# EAGLE design PetitCool_MainShield (EAGLE 7.3.0)
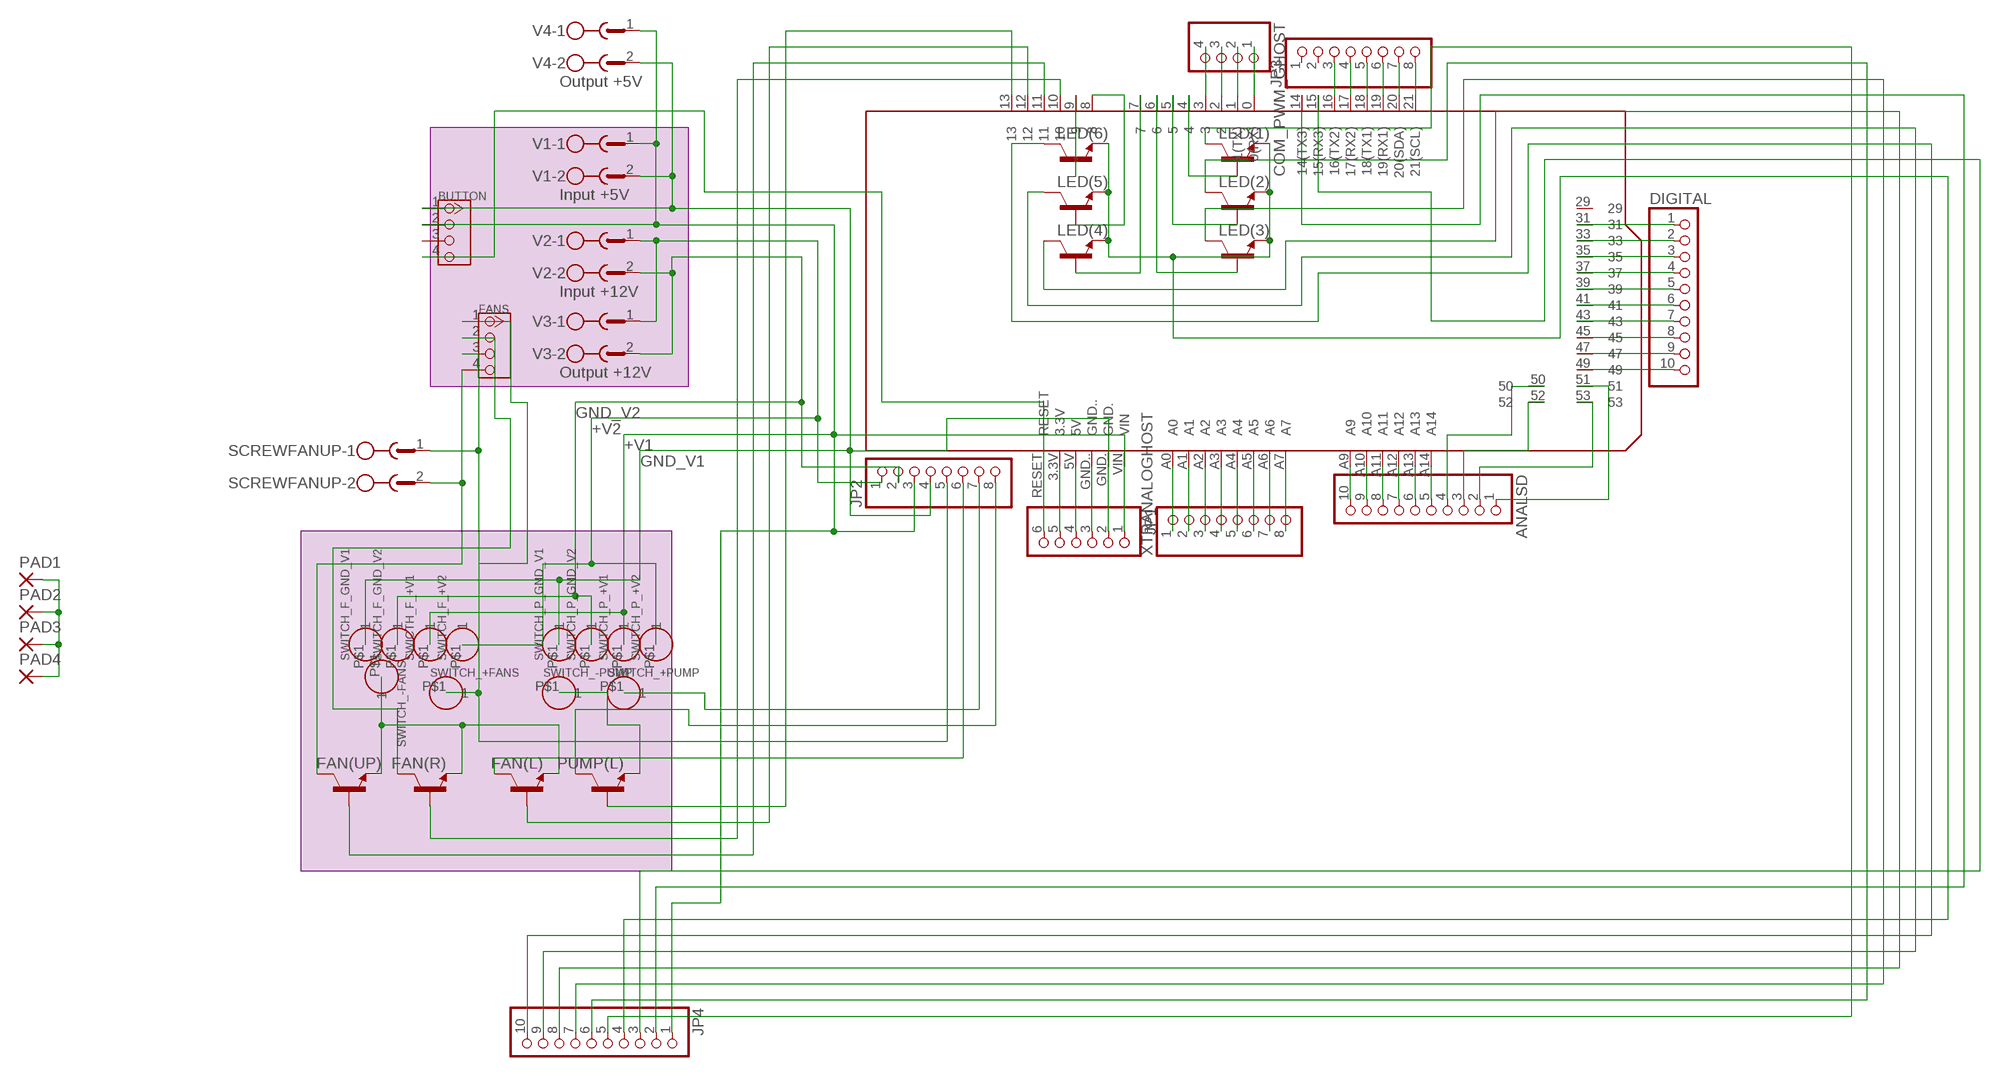
[diagram p0: schematic, sheet 1]

## Parts
ANALSD  PINHD-1X10  [1X10]
BUTTON  TWIG-4P-2.0-2.0  [4P-2.0]
COM_PWM_GHOST  PINHD-1X4  [1X04]
DIGITAL  PINHD-1X10  [1X10]
FAN(L)  DAR500  [DAR500]
FAN(R)  DAR500  [DAR500]
FAN(UP)  DAR500  [DAR500]
FANS  TWIG-4P-2.0-2.0  [4P-2.0]
JP1  PINHD-1X6  [1X06]
JP2  PINHD-1X8  [1X08]
JP3  PINHD-1X8  [1X08]
JP4  PINHD-1X10  [1X10]
LED(1)  DAR500  [DAR500]
LED(2)  DAR500  [DAR500]
LED(3)  DAR500  [DAR500]
LED(4)  DAR500  [DAR500]
LED(5)  DAR500  [DAR500]
LED(6)  DAR500  [DAR500]
PAD1  2,15/1,0  [2,15/1,0]
PAD2  2,15/1,0  [2,15/1,0]
PAD3  2,15/1,0  [2,15/1,0]
PAD4  2,15/1,0  [2,15/1,0]
PCB1  SHIELD_MEGA  [SHIELD_MEGA]
PUMP(L)  DAR500  [DAR500]
SCREWFANUP  MSTBV2  [MSTBV2]
SWICTH_F_+V1  HEADER-1P-70  [1P-100/70MIL]
SWITCH_+FANS  HEADER-1P-70  [1P-100/70MIL]
SWITCH_+PUMP  HEADER-1P-70  [1P-100/70MIL]
SWITCH_-FANS  HEADER-1P-70  [1P-100/70MIL]
SWITCH_-PUMP  HEADER-1P-70  [1P-100/70MIL]
SWITCH_F_+V2  HEADER-1P-70  [1P-100/70MIL]
SWITCH_F_GND_V1  HEADER-1P-70  [1P-100/70MIL]
SWITCH_F_GND_V2  HEADER-1P-70  [1P-100/70MIL]
SWITCH_P_+V1  HEADER-1P-70  [1P-100/70MIL]
SWITCH_P_+V2  HEADER-1P-70  [1P-100/70MIL]
SWITCH_P_GND_V1  HEADER-1P-70  [1P-100/70MIL]
SWITCH_P_GND_V2  HEADER-1P-70  [1P-100/70MIL]
V1  Input +5V  MSTBV2  [MSTBV2]
V2  Input +12V  MSTBV2  [MSTBV2]
V3  Output +12V  MSTBV2  [MSTBV2]
V4  Output +5V  MSTBV2  [MSTBV2]
XTRANALOGHOST  PINHD-1X8  [1X08]

## Nets
+FAN(UP/R/L): FANS.1 FANS.3 JP2.5 SCREWFANUP.1 SWITCH_+FANS.P$1
+PUMP: JP2.7 SWITCH_+PUMP.P$1
+V1: BUTTON.2 JP1.1 JP2.3 JP4.1 PCB1.VIN SWICTH_F_+V1.P$1 SWITCH_P_+V1.P$1 V1.1 V4.1
+V2: JP2.1 SWITCH_F_+V2.P$1 SWITCH_P_+V2.P$1 V2.1 V3.1
-FAN(L): FAN(L).1(C) JP2.6
-FAN(R): FAN(R).1(C) FANS.2
-FAN(UP): FAN(UP).1(C) FANS.4 SCREWFANUP.2
-FANS: FAN(L).3(E) FAN(R).3(E) FAN(UP).3(E) SWITCH_-FANS.P$1
-LED(1): JP4.5 LED(1).1(C)
-LED(2): JP4.6 LED(2).1(C)
-LED(3): JP4.7 LED(3).1(C)
-LED(4): JP4.8 LED(4).1(C)
-LED(5): JP4.9 LED(5).1(C)
-LED(6): JP4.10 LED(6).1(C)
-LEDS: JP4.4 LED(1).3(E) LED(2).3(E) LED(3).3(E) LED(4).3(E) LED(5).3(E) LED(6).3(E)
-PUMP: PUMP(L).3(E) SWITCH_-PUMP.P$1
-PUMP(L): JP2.8 PUMP(L).1(C)
CAM(RX): JP4.3 PCB1.15(15(RX3))
CAM(TX): JP4.2 PCB1.14(14(TX3))
CTRL_FAN(L): FAN(L).2(B) PCB1.12
CTRL_FAN(R): FAN(R).2(B) PCB1.10
CTRL_FAN(UP): FAN(UP).2(B) PCB1.11
CTRL_PUMP: PCB1.13 PUMP(L).2(B)
GND_V1: BUTTON.1 JP1.2 JP2.4 PAD1.1(P) PAD2.1(P) PAD3.1(P) PAD4.1(P) PCB1.GND. SWITCH_F_GND_V1.P$1 SWITCH_P_GND_V1.P$1 V1.2 V4.2
GND_V2: JP2.2 SWITCH_F_GND_V2.P$1 SWITCH_P_GND_V2.P$1 V2.2 V3.2
N$1: ANALSD.3 PCB1.52
N$2: ANALSD.2 PCB1.53
N$3: ANALSD.1 PCB1.51
N$5: JP1.5 PCB1.3.3V
N$6: JP1.4 PCB1.5V
N$7: JP1.3 PCB1.GND..
N$8: COM_PWM_GHOST.1 PCB1.0(0(RX))
N$9: COM_PWM_GHOST.2 PCB1.1(1(TX))
N$10: COM_PWM_GHOST.3 PCB1.2
N$11: COM_PWM_GHOST.4 PCB1.3
N$12: ANALSD.10 PCB1.A9
N$13: ANALSD.9 PCB1.A10
N$14: ANALSD.8 PCB1.A11
N$15: ANALSD.7 PCB1.A12
N$16: ANALSD.6 PCB1.A13
N$17: ANALSD.5 PCB1.A14
N$19: LED(1).2(B) PCB1.4
N$20: DIGITAL.1 PCB1.31
N$21: DIGITAL.2 PCB1.33
N$22: DIGITAL.3 PCB1.35
N$23: DIGITAL.4 PCB1.37
N$24: DIGITAL.5 PCB1.39
N$25: DIGITAL.6 PCB1.41
N$26: DIGITAL.7 PCB1.43
N$27: DIGITAL.8 PCB1.45
N$28: DIGITAL.9 PCB1.47
N$29: DIGITAL.10 PCB1.49
N$30: PCB1.A0 XTRANALOGHOST.1
N$31: PCB1.A1 XTRANALOGHOST.2
N$32: PCB1.A2 XTRANALOGHOST.3
N$33: ANALSD.4 PCB1.50
N$34: PCB1.A3 XTRANALOGHOST.4
N$35: PCB1.A4 XTRANALOGHOST.5
N$36: PCB1.A5 XTRANALOGHOST.6
N$37: LED(2).2(B) PCB1.5
N$38: LED(3).2(B) PCB1.6
N$39: LED(4).2(B) PCB1.7
N$40: LED(5).2(B) PCB1.8
N$41: LED(6).2(B) PCB1.9
N$42: PCB1.A6 XTRANALOGHOST.7
N$43: PCB1.A7 XTRANALOGHOST.8
RESET: BUTTON.4 JP1.6 PCB1.RESET
RX_BT: JP3.4 PCB1.17(17(RX2))
RX_LEDBAR: JP3.6 PCB1.19(19(RX1))
SCL_(RTC+4D): JP3.8 PCB1.21(21(SCL))
SDA_(RTC+4D): JP3.7 PCB1.20(20(SDA))
TX_BT: JP3.3 PCB1.16(16(TX2))
TX_LEDBAR: JP3.5 PCB1.18(18(TX1))
Unconnected: BUTTON.3 JP3.1 JP3.2 PCB1.29

## Library data of the parts
ANALSD DIGITAL JP4 = pinhead:PINHD-1X10: PIN HEADER
BUTTON FANS = Connector:TWIG-4P-2.0
COM_PWM_GHOST = pinhead:PINHD-1X4: PIN HEADER
FAN(L) FAN(R) FAN(UP) LED(1) LED(2) LED(3) LED(4) LED(5) LED(6) PUMP(L) = Biobot_1105:DAR500: NPN Transistor : DARLINGTON 500 mA
JP1 = pinhead:PINHD-1X6: PIN HEADER
JP2 JP3 XTRANALOGHOST = pinhead:PINHD-1X8: PIN HEADER
PAD1-PAD4 = wirepad:2,15/1,0: THROUGH-HOLE PAD
PCB1 = PetitCool_Arduino:SHIELD_MEGA: Device for representing
SCREWFANUP V1-V4 = con-phoenix-508:MSTBV2: PHOENIX; MPN: MSTBV 2,5/2-GF-5.08; OC_FARNELL: 1792792; OC_NEWARK: 69R9845
SWICTH_F_+V1 SWITCH_+FANS SWITCH_+PUMP SWITCH_-FANS SWITCH_-PUMP SWITCH_F_+V2 SWITCH_F_GND_V1 SWITCH_F_GND_V2 SWITCH_P_+V1 SWITCH_P_+V2 SWITCH_P_GND_V1 SWITCH_P_GND_V2 = Connector:HEADER-1P

## Board
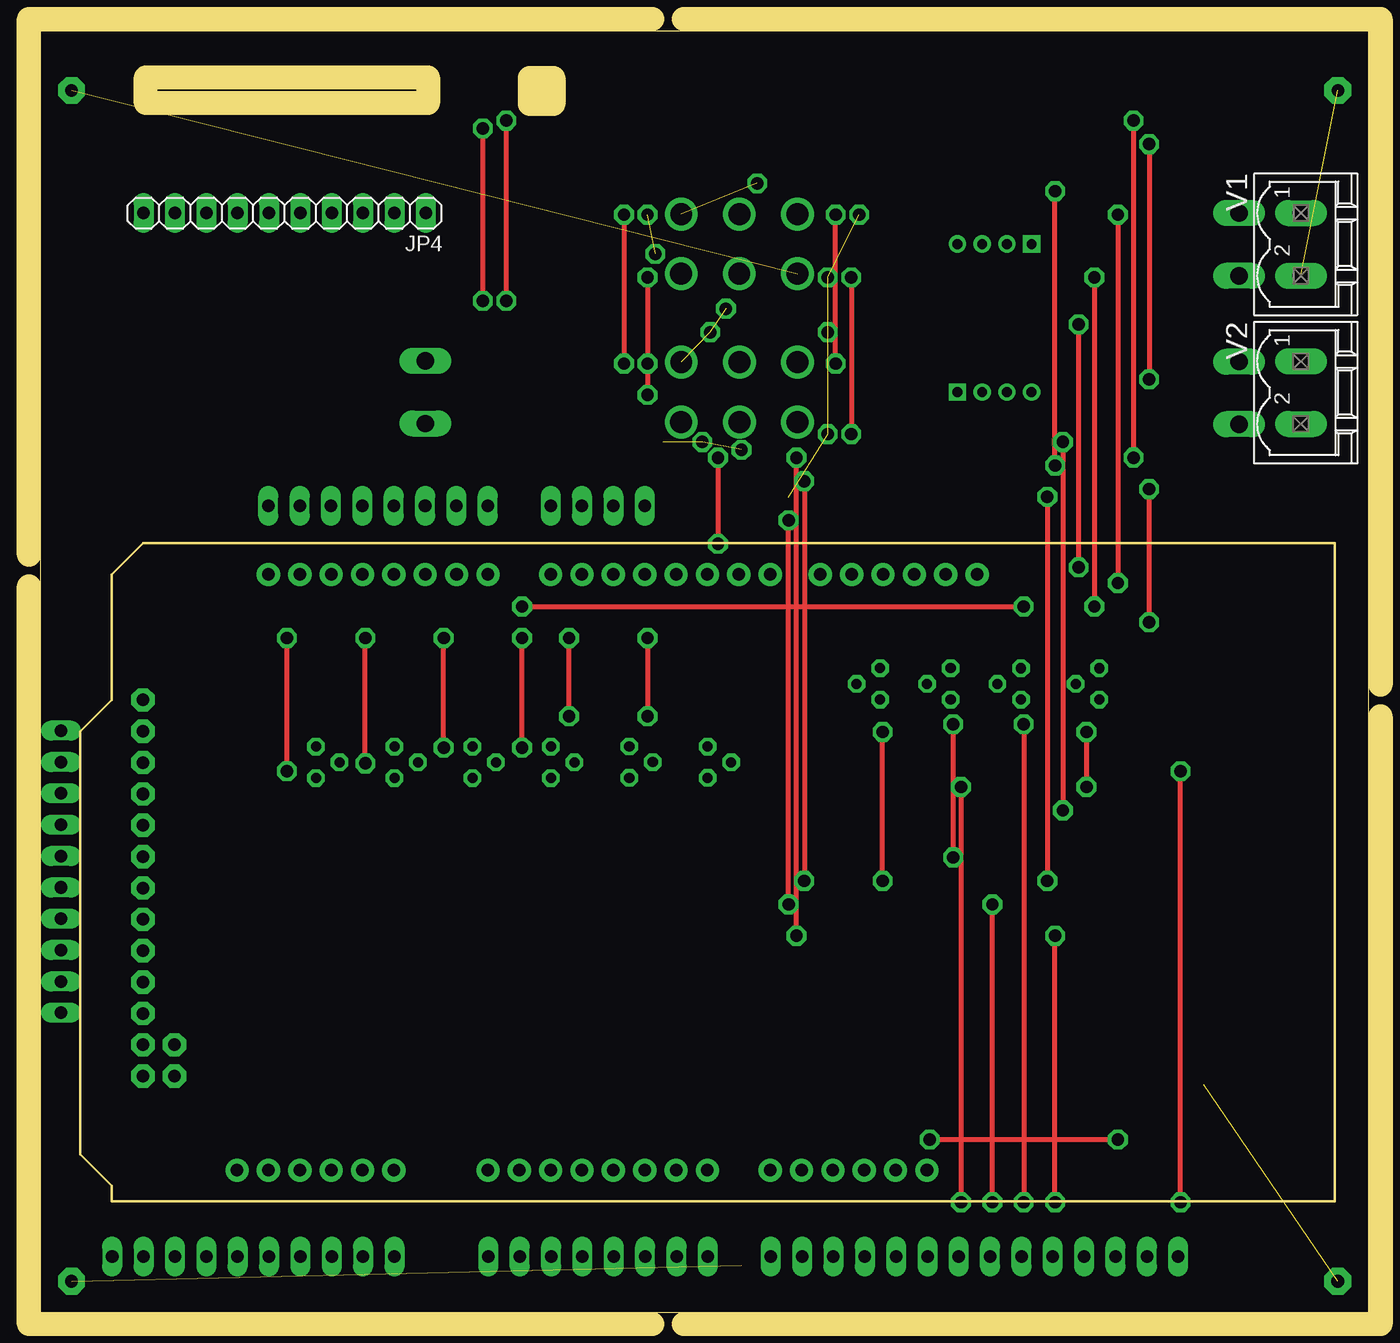
[diagram p1: board, top side]
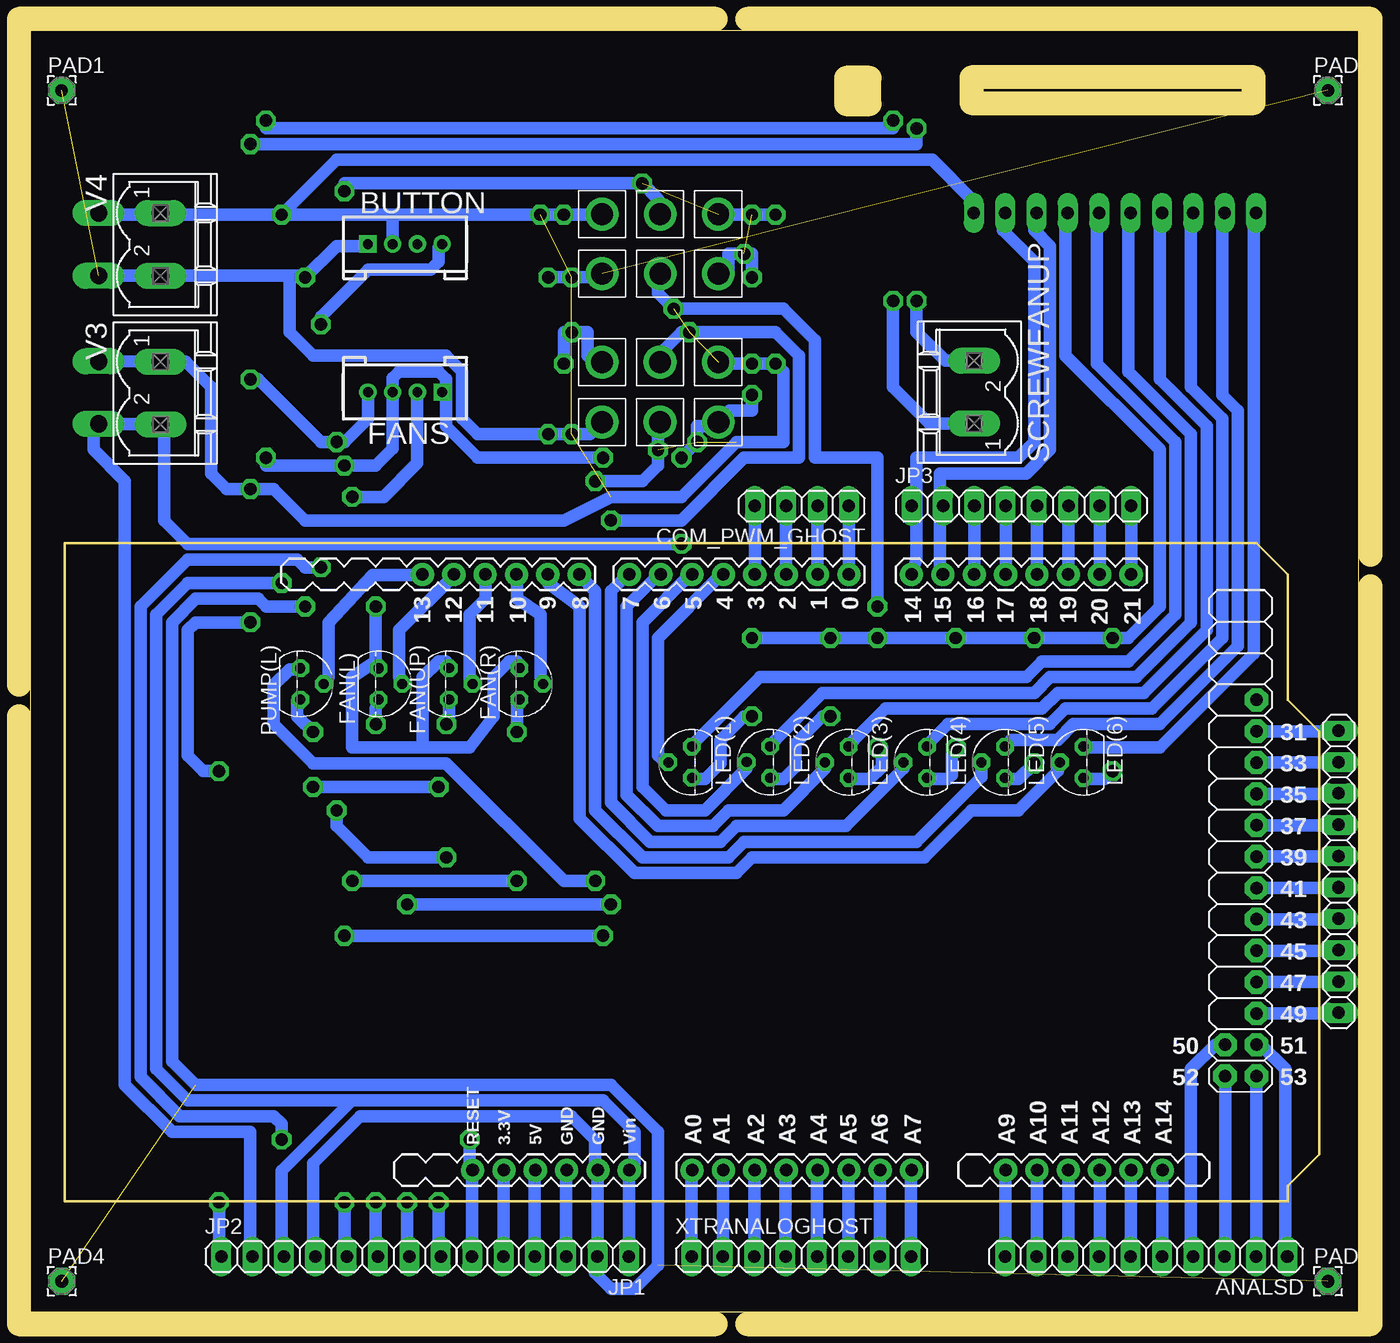
[diagram p2: board, bottom side, seen from below]

Size 107.57 x 103.79 mm. Coordinates in mm from the lower left corner, seen from the top.
Outline: 107.57,0 107.57,103.79 0,103.79 0,0 107.57,0
Copper layers 16: Bottom 0.035mm
Design rules "eC_1Layer_PClass6_BaseCopperO35_eCDefault": minimum track width 0.15mm, minimum drill 0.35mm, track to track 0.15mm, track to pad 0.15mm, pad to pad 0.15mm, via to via 0.15mm, smd to smd 0mil, copper to edge 0.25mm, drill to drill 0.35mm, minimum pad ring 0.3mm, minimum via ring 0.3mm, stop-mask expansion 0mil, vias tented up to drill 0.45mm, thermal gap 0.2mm
bKeepout: 4 lines
Milling: 16 lines

### Footprints (pad centres in the part's own frame; a part is rotated, then mirrored left to right if it is on the bottom)
1X10 = drill 1.016 long: 1 -11.43,0; 2 -8.89,0; 3 -6.35,0; 4 -3.81,0; 5 -1.27,0; 6 1.27,0; 7 3.81,0; 8 6.35,0; 9 8.89,0; 10 11.43,0
4P-2.0 = drill 0.8 pad 1.27 square: 1 -3,0 | drill 0.8 pad 1.27: 2 -1,0; 3 1,0; 4 3,0
1X04 = drill 1.016 long: 1 -3.81,0; 2 -1.27,0; 3 1.27,0; 4 3.81,0
DAR500 = drill 0.813 octagon: 1 1.27,0; 2 0,1.905; 3 -1.27,0
1X06 = drill 1.016 long: 1 -6.35,0; 2 -3.81,0; 3 -1.27,0; 4 1.27,0; 5 3.81,0; 6 6.35,0
1X08 = drill 1.016 long: 1 -8.89,0; 2 -6.35,0; 3 -3.81,0; 4 -1.27,0; 5 1.27,0; 6 3.81,0; 7 6.35,0; 8 8.89,0
2,15/1,0 = drill 1.016 pad 2.159 octagon: 1 0,0
SHIELD_MEGA = drill 1.016 pad 1.88: 0 63.5,50.8; 1 60.96,50.8; 2 58.42,50.8; 3 55.88,50.8; 3.3V 35.56,2.54; 4 53.34,50.8; 5 50.8,50.8; 5V 38.1,2.54; 6 48.26,50.8; 7 45.72,50.8; 8 41.656,50.8; 9 39.116,50.8; 10 36.576,50.8; 11 34.036,50.8; 12 31.496,50.8; 13 28.956,50.8; 14 68.58,50.8; 15 71.12,50.8; 16 73.66,50.8; 17 76.2,50.8; 18 78.74,50.8; 19 81.28,50.8; 20 83.82,50.8; 21 86.36,50.8; A0 50.8,2.54; A1 53.34,2.54; A2 55.88,2.54; A3 58.42,2.54; A4 60.96,2.54; A5 63.5,2.54; A6 66.04,2.54; A7 68.58,2.54; A9 76.2,2.54; A10 78.74,2.54; A11 81.28,2.54; A12 83.82,2.54; A13 86.36,2.54; A14 88.9,2.54; GND. 43.18,2.54; GND.. 40.64,2.54; RESET 33.02,2.54; VIN 45.72,2.54 | drill 1.016 pad 1.88 octagon: 29 96.52,40.64; 31 96.52,38.1; 33 96.52,35.56; 35 96.52,33.02; 37 96.52,30.48; 39 96.52,27.94; 41 96.52,25.4; 43 96.52,22.86; 45 96.52,20.32; 47 96.52,17.78; 49 96.52,15.24; 50 93.98,12.7; 51 96.52,12.7; 52 93.98,10.16; 53 96.52,10.16
MSTBV2 = drill 1.397 long: 1 -2.54,0; 2 2.54,0
1P-100/70MIL = drill 1.778: P$1 0,0

### Placement (x,y rotation side)
ANALSD  17.22,4.5 180 bottom
BUTTON  77.27,86.53 0 bottom
COM_PWM_GHOST  45.12,65.3 180 bottom
DIGITAL  1.62,35.67 270 bottom
FAN(L)  79.4,50.89 270 bottom
FAN(R)  67.99,50.89 270 bottom
FAN(UP)  73.71,50.89 270 bottom
FANS  77.26,74.53 180 bottom
JP1  65.48,4.5 180 bottom
JP2  83.26,4.5 0 bottom
JP3  27.33,65.31 0 bottom
JP4  19.76,89.03 180 top
LED(1)  54.02,44.54 90 bottom
LED(2)  47.67,44.55 90 bottom
LED(3)  41.32,44.54 90 bottom
LED(4)  34.98,44.54 90 bottom
LED(5)  28.65,44.54 90 bottom
LED(6)  22.29,44.54 90 bottom
PAD1  105.07,98.97 0 bottom
PAD2  2.5,98.97 0 bottom
PAD3  2.5,2.5 0 bottom
PAD4  105.07,2.5 0 bottom
PCB1  104.81,8.96 0 bottom
PUMP(L)  85.75,50.89 270 bottom
SCREWFANUP  31.15,74.52 90 bottom
SWICTH_F_+V1  61.29,88.94 0 bottom
SWITCH_+FANS  56.59,88.94 0 bottom
SWITCH_+PUMP  56.59,76.94 0 bottom
SWITCH_-FANS  56.59,84.11 0 bottom
SWITCH_-PUMP  56.59,72.11 0 bottom
SWITCH_F_+V2  51.89,88.94 0 bottom
SWITCH_F_GND_V1  61.29,84.11 0 bottom
SWITCH_F_GND_V2  51.89,84.11 0 bottom
SWITCH_P_+V1  61.28,76.94 0 bottom
SWITCH_P_+V2  51.89,76.94 0 bottom
SWITCH_P_GND_V1  61.29,72.11 0 bottom
SWITCH_P_GND_V2  51.88,72.11 0 bottom
V1  102.08,86.5 270 top
V2  102.08,74.49 270 top
V3  97.07,74.46 270 bottom
V4  97.07,86.49 270 bottom
XTRANALOGHOST  45.16,4.5 0 bottom

### Tracks (layer width: path | path; a pad name or v marks a point on that pad's centre or on a via)
+FAN(UP/R/L)  (via drill 1)
  Top 0.406: v82.17,68.58 v82.17,90.81 | v82.17,8.89 v82.17,30.48 | v61.22,30.48 v61.22,69.22 | v37.72,81.92 v37.72,96.52 | v88.52,96.52 v88.52,69.22
  Bottom 1.016: v82.17,30.48 v61.22,30.48 | v61.22,69.22 71.38,69.22 73.92,71.76 73.92,74.18 | 73.92,74.18 73.92,74.3 | 73.92,74.3 74.15,74.53 FANS.1 73.92,74.18 | 73.92,74.3 73.92,75.57 74.55,76.2 77.73,76.2 78.26,75.66 FANS.3 78.26,69.95 79.63,68.58 v82.17,68.58 88.52,68.58 v88.52,69.22 | v82.17,90.81 82.17,91.44 58.04,91.44 56.77,90.17 56.77,88.92 56.59,88.92 SWITCH_+FANS.P$1 | SCREWFANUP.1 34.77,71.98 37.72,74.93 v37.72,81.92 | v37.72,96.52 37.72,95.89 88.52,95.89 v88.52,96.52 | JP2.5 82.17,4.68 v82.17,8.89
+PUMP  (via drill 1)
  Top 0.406: v77.09,8.89 v77.09,33.02 | v60.58,33.02 v60.58,64.14
  Bottom 1.016: v77.09,33.02 v60.58,33.02 | v60.58,64.14 54.87,64.14 49.79,69.22 45.34,69.22 45.34,77.47 47.25,79.38 54.87,79.38 56.77,77.47 56.77,77.13 SWITCH_+PUMP.P$1 | JP2.7 77.09,4.68 v77.09,8.89
+V1  (via drill 1)
  Top 0.406: v87.25,88.9 v87.25,59.06 | v64.39,76.84 v64.39,88.9
  Bottom 0.406: V4.1 102.08,89.03 V1.1
  Bottom 1.016: 81.54,17.15 61.22,17.15 58.68,14.61 58.68,12.07 PCB1.VIN 59.13,11.45 JP1.1 | 81.54,17.15 87.25,11.43 87.25,5.08 87.07,4.9 JP2.3 | v87.25,59.06 94.87,59.06 97.41,56.52 97.41,19.69 94.87,17.15 81.54,17.15 | v87.25,88.9 78.36,88.9 | 78.36,88.9 v64.39,88.9 61.29,88.9 SWICTH_F_+V1.P$1 | v87.25,88.9 101.94,88.9 V1.1 | v87.25,88.9 82.81,93.35 34.55,93.35 31.37,90.17 31.37,89.21 JP4.1 | BUTTON.2 78.26,88.81 78.36,88.9 | SWITCH_P_+V1.P$1 61.39,77.47 62.49,77.47 62.49,79.38 64.39,79.38 v64.39,76.84
+V2  (via drill 1)  (10 unrouted)
  Top 0.406: v92.33,8.89 v92.33,43.82 | v89.79,55.88 v89.79,66.68 | v47.25,88.9 v47.25,76.84
  Bottom 1.016: V2.1 V3.1 95.03,77 92.97,74.93 92.97,67.95 91.7,66.68 v89.79,66.68 87.89,66.68 85.35,64.14 64.39,64.14 60.58,66.04 54.87,66.04 50.42,70.49 46.61,70.49 46.61,76.2 v47.25,76.84 v49.15,76.84 51.78,76.84 SWITCH_P_+V2.P$1 | v92.33,43.82 93.6,43.82 94.87,45.09 94.87,55.25 94.24,55.88 v89.79,55.88 | SWITCH_F_+V2.P$1 51.85,88.9 v49.15,88.9 v47.25,88.9 | JP2.1 92.33,4.68 v92.33,8.89
  other vias: 58.04,91.44 49.79,85.73 66.3,88.9 63.76,83.82 55.5,81.28 53.6,70.49 56.77,69.85 54.23,79.38 63.76,71.12 63.76,79.38
-FAN(L)  (via drill 1)
  Top 0.406: v79.63,47.63 v79.63,8.89
  Bottom 1.016: v79.63,47.63 79.63,48.9 FAN(L).1 | JP2.6 79.63,4.68 v79.63,8.89
-FAN(R)  (via drill 1)
  Top 0.406: v81.54,66.04 v81.54,34.93 | v68.2,34.93 v68.2,46.99
  Bottom 1.016: v81.54,66.04 79,66.04 76.26,68.77 FANS.2 | v68.2,46.99 68.2,49.53 FAN(R).1 | v81.54,34.93 v68.2,34.93
-FAN(UP)  (via drill 1)
  Top 0.406: v82.81,70.49 v82.81,40.64 | v73.92,36.83 v73.92,47.63 | v35.82,81.92 v35.82,95.89 | v89.79,94.62 v89.79,75.57
  Bottom 1.016: v82.81,40.64 82.81,39.37 80.27,36.83 v73.92,36.83 | FANS.4 80.26,72.39 82.17,70.49 v82.81,70.49 84.08,70.49 89.16,75.57 v89.79,75.57 | SCREWFANUP.2 33.5,77.06 35.82,79.38 v35.82,81.92 | v35.82,95.89 35.82,94.62 v89.79,94.62 | FAN(UP).1 73.71,47.83 v73.92,47.63
-FANS  (via drill 1)
  Top 0.406: v38.99,57.15 v79.63,57.15
  Bottom 1.016: 79.63,52.71 v79.63,57.15 | 75.82,45.72 72.01,45.72 70.11,48.26 70.11,51.44 68.84,52.71 68.2,52.71 FAN(R).3 | FAN(L).3 79.63,52.71 | 79.63,52.71 81.54,51.44 81.54,45.72 75.82,45.72 | FAN(UP).3 73.92,52.71 74.55,52.71 75.82,51.44 75.82,45.72 | v38.99,57.15 38.99,69.22 44.07,69.22 44.07,78.74 46.61,81.28 55.5,81.28 56.77,82.55 56.77,83.93 SWITCH_-FANS.P$1
-LED(1)
  Bottom 1.016: LED(1).1 54.02,45.93 48.52,51.44 26.93,51.44 25.66,52.71 18.67,52.71 14.86,56.52 14.86,70.49 21.21,76.84 21.21,88.84 JP4.5
-LED(2)
  Bottom 1.016: LED(2).1 47.25,46.36 43.44,50.17 26.29,50.17 25.02,51.44 18.04,51.44 13.59,55.88 13.59,71.12 18.67,76.2 18.67,88.84 JP4.6
-LED(3)
  Bottom 1.016: LED(3).1 40.9,46.36 38.36,48.9 25.66,48.9 24.39,50.17 17.4,50.17 12.32,55.25 12.32,71.76 16.13,75.57 16.13,88.84 JP4.7
-LED(4)
  Bottom 1.016: LED(4).1 34.97,45.93 33.28,47.63 25.02,47.63 23.75,48.9 16.77,48.9 11.05,54.61 11.05,72.39 13.59,74.93 13.59,88.84 JP4.8
-LED(5)
  Bottom 1.016: LED(5).1 28.65,45.72 28.2,46.36 24.39,46.36 23.12,47.63 16.13,47.63 9.78,53.98 9.78,73.03 11.05,74.3 11.05,88.84 JP4.9
-LED(6)
  Bottom 1.016: LED(6).1 22.29,45.91 21.85,45.72 16.13,45.72 8.51,53.34 8.51,88.84 JP4.10
-LEDS  (via drill 1)
  Top 0.406: v49.15,54.61 v49.15,48.26 | v32.64,45.72 v32.64,54.61 | v26.29,44.45 v26.29,54.61 | v19.94,43.82 v19.94,54.61 | v42.8,48.26 v42.8,54.61 | v38.99,45.72 v38.99,54.61
  Bottom 0.254: 25.96,44.53 25.96,44.75 v26.29,44.45 | 38.64,45.8 38.64,46.01 v38.99,45.72
  Bottom 1.016: LED(6).3 21.93,43.27 21.85,43.18 20.58,43.18 v19.94,43.82 | LED(5).3 28.83,43.18 27.56,43.18 v26.29,44.45 25.96,44.53 | LED(4).3 34.63,43.27 34.55,43.18 33.28,43.18 32.94,43.52 32.94,45.72 v32.64,45.72 | LED(3).3 40.98,43.27 40.9,43.18 39.63,43.18 38.64,44.17 38.64,45.8 | LED(1).3 53.6,43.18 52.96,43.18 51.69,44.45 51.69,46.36 49.79,48.26 v49.15,48.26 | v49.15,54.61 v42.8,54.61 v38.99,54.61 v32.64,54.61 v26.29,54.61 v19.94,54.61 18.67,54.61 16.13,57.15 16.13,69.85 23.75,77.47 23.75,88.84 JP4.4 | LED(2).3 47.58,43.18 46.61,43.18 45.64,44.15 45.64,46.06 43.44,48.26 v42.8,48.26
-PUMP  (via drill 1)
  Top 0.406: v61.85,67.31 v61.85,34.93
  Bottom 1.016: v61.85,34.93 64.39,34.93 73.92,44.45 84.71,44.45 87.89,47.63 87.89,50.8 86.62,52.07 85.75,52.07 PUMP(L).3 | v61.85,67.31 58.04,67.31 56.77,68.58 56.77,71.93 SWITCH_-PUMP.P$1
-PUMP(L)  (via drill 1)
  Top 0.406: v84.71,46.99 v84.71,42.55 | v74.55,42.55 v74.55,8.89
  Bottom 1.016: v84.71,46.99 85.98,48.26 85.98,49.53 PUMP(L).1 | v84.71,42.55 v74.55,42.55 | JP2.8 74.55,4.68 v74.55,8.89
CAM(RX)
  Bottom 1.016: PCB1.15 33.91,60.33 33.91,67.95 26.93,67.95 25.02,69.85 25.02,86.36 26.29,87.63 26.29,88.84 JP4.3
CAM(TX)
  Bottom 1.016: PCB1.14 35.82,60.96 35.82,69.22 27.56,69.22 26.29,70.49 26.29,85.09 28.83,87.63 28.83,88.84 JP4.2
CTRL_FAN(L)
  Bottom 1.016: FAN(L).2 77.73,51.44 77.73,55.25 73.22,59.76 PCB1.12
CTRL_FAN(R)
  Bottom 1.016: FAN(R).2 66.3,51.44 66.3,56.52 68.2,57.79 68.2,59.69 PCB1.10
CTRL_FAN(UP)
  Bottom 1.016: 70.74,59.06 70.74,57.79 72.01,56.52 72.01,51.1 FAN(UP).2 | 70.74,59.69 70.74,59.06 | 70.74,59.06 70.77,59.09 PCB1.11
CTRL_PUMP
  Bottom 1.016: PUMP(L).2 83.44,51.44 83.44,55.88 79.88,59.69 75.91,59.69 PCB1.13
GND_V1  (via drill 1)  (4 unrouted)
  Top 0.406: v85.35,83.82 v85.35,57.15 | v65.66,83.82 v65.66,71.12
  Bottom 0.406: V4.2 102.08,83.95 V1.2
  Bottom 1.016: v85.35,57.15 88.52,57.15 89.16,57.79 94.24,57.79 96.14,55.88 96.14,20.32 94.24,18.42 60.58,18.42 56.77,14.61 56.77,3.81 58.68,1.91 60.58,1.91 61.85,3.18 61.85,4.32 JP1.2 61.67,11.45 | PCB1.GND. 61.85,11.72 61.85,13.97 63.76,15.88 80.9,15.88 84.71,12.07 84.71,5.08 84.53,4.9 JP2.4 | 61.85,11.27 61.67,11.45 | V1.2 86.62,83.96 | BUTTON.1 80.43,86.36 82.81,86.36 v85.35,83.82 85.48,83.96 86.62,83.96 | v65.66,83.82 61.57,83.82 SWITCH_F_GND_V1.P$1 | 86.62,83.96 86.62,79.38 84.71,77.47 73.92,77.47 72.65,76.2 72.65,72.39 71.38,71.12 v65.66,71.12 62.28,71.12 SWITCH_P_GND_V1.P$1 | 61.85,11.43 61.63,11.43 PCB1.GND. | PCB1.GND. 61.67,11.45
GND_V2  (via drill 1)
  Top 0.406: v54.87,69.22 v54.87,62.23 | v49.15,83.82 v49.15,74.3
  Bottom 1.016: v54.87,62.23 94.87,62.23 96.78,64.14 96.78,71.62 V3.2 97.1,71.95 V2.2 102.49,71.76 102.49,69.85 99.95,67.31 99.95,18.42 96.14,14.61 89.79,14.61 89.79,4.68 JP2.2 | v54.87,69.22 53.6,70.49 53.6,71.76 52.24,71.76 SWITCH_P_GND_V2.P$1 50.97,73.03 49.15,73.03 v49.15,74.3 | SWITCH_F_GND_V2.P$1 51.59,84.46 51.06,84.46 51.06,85.73 49.15,85.73 v49.15,83.82
N$1
  Bottom 1.016: ANALSD.3 10.83,4.5 PCB1.52
N$2
  Bottom 1.016: ANALSD.2 8.29,4.5 PCB1.53
N$3
  Bottom 1.016: PCB1.51 7.94,21.66 5.97,19.69 5.97,4.5 ANALSD.1
N$5
  Bottom 1.016: PCB1.3.3V 69.29,11.45 JP1.5
N$6
  Bottom 1.016: PCB1.5V 66.75,11.45 JP1.4
N$7
  Bottom 1.016: PCB1.GND.. 64.21,11.45 JP1.3
N$8
  Bottom 1.016: COM_PWM_GHOST.1 PCB1.0
N$9
  Bottom 1.016: COM_PWM_GHOST.2 PCB1.1
N$10
  Bottom 1.016: COM_PWM_GHOST.3 PCB1.2
N$11
  Bottom 1.016: COM_PWM_GHOST.4 PCB1.3
N$12
  Bottom 1.016: ANALSD.10 28.61,4.5 PCB1.A9
N$13
  Bottom 1.016: ANALSD.9 26.07,4.5 PCB1.A10
N$14
  Bottom 1.016: ANALSD.8 23.53,4.5 PCB1.A11
N$15
  Bottom 1.016: ANALSD.7 20.99,4.5 PCB1.A12
N$16
  Bottom 1.016: ANALSD.6 18.45,4.5 PCB1.A13
N$17
  Bottom 1.016: ANALSD.5 15.91,4.5 PCB1.A14
N$19
  Bottom 1.016: PCB1.4 51.69,59.69 56.77,54.61 56.77,45.09 56.14,44.45 LED(1).2
N$20
  Bottom 1.016: PCB1.31 1.62,47.06 DIGITAL.1
N$21
  Bottom 1.016: PCB1.33 1.62,44.52 DIGITAL.2
N$22
  Bottom 1.016: PCB1.35 1.62,41.98 DIGITAL.3
N$23
  Bottom 1.016: PCB1.37 1.62,39.44 DIGITAL.4
N$24
  Bottom 1.016: PCB1.39 1.62,36.9 DIGITAL.5
N$25
  Bottom 1.016: PCB1.41 1.62,34.36 DIGITAL.6
N$26
  Bottom 1.016: PCB1.43 1.62,31.82 DIGITAL.7
N$27
  Bottom 1.016: PCB1.45 1.62,29.28 DIGITAL.8
N$28
  Bottom 1.016: PCB1.47 1.62,26.74 DIGITAL.9
N$29
  Bottom 1.016: PCB1.49 1.62,24.2 DIGITAL.10
N$30
  Bottom 1.016: XTRANALOGHOST.1 54.04,11.46 PCB1.A0
N$31
  Bottom 1.016: XTRANALOGHOST.2 51.5,11.46 PCB1.A1
N$32
  Bottom 1.016: XTRANALOGHOST.3 48.96,11.46 PCB1.A2
N$33
  Bottom 1.016: PCB1.50 11.62,21.66 13.59,19.69 13.59,4.5 ANALSD.4
N$34
  Bottom 1.016: XTRANALOGHOST.4 46.42,11.46 PCB1.A3
N$35
  Bottom 1.016: XTRANALOGHOST.5 43.88,11.46 PCB1.A4
N$36
  Bottom 1.016: XTRANALOGHOST.6 41.34,11.46 PCB1.A5
N$37
  Bottom 1.016: PCB1.5 54.17,59.76 58.04,55.88 58.04,42.55 56.14,40.64 52.96,40.64 49.58,44.02 LED(2).2
N$38
  Bottom 1.016: PCB1.6 56.71,59.76 59.31,57.15 59.31,41.91 56.77,39.37 52.33,39.37 51.06,40.64 46.61,40.64 43.23,44.02 LED(3).2
N$39
  Bottom 1.016: PCB1.7 59.25,59.76 60.58,58.42 60.58,41.28 57.41,38.1 51.69,38.1 50.42,39.37 41.53,39.37 36.88,44.02 LED(4).2
N$40
  Bottom 1.016: LED(5).2 30.55,43.37 35.82,38.1 49.79,38.1 51.06,36.83 58.04,36.83 61.85,40.64 61.85,58.42 63.12,59.69 63.12,59.76 PCB1.8
N$41
  Bottom 1.016: PCB1.9 65.69,59.09 65.66,59.06 63.12,57.15 63.12,40.01 58.68,35.56 50.42,35.56 49.15,36.83 35.18,36.83 31.37,40.64 27.56,40.64 24.39,43.82 24.39,44.45 LED(6).2
N$42
  Bottom 1.016: XTRANALOGHOST.7 38.8,11.46 PCB1.A6
N$43
  Bottom 1.016: XTRANALOGHOST.8 36.26,11.46 PCB1.A7
RESET  (via drill 1)
  Top 0.406: v84.08,80.01 v84.08,60.33 | v87.25,13.97 v72.01,13.97
  Bottom 1.016: v72.01,13.97 72.01,12.07 | 72.01,12.07 PCB1.RESET | v87.25,13.97 87.25,15.24 87.89,15.88 95.51,15.88 98.68,19.05 98.68,57.15 94.87,60.96 85.98,60.96 85.35,60.33 v84.08,60.33 | v84.08,80.01 84.08,80.65 80.27,84.46 75.19,84.46 74.55,85.09 74.55,86.24 BUTTON.4 | 72.01,12.07 71.79,11.43 PCB1.RESET | PCB1.RESET 71.83,11.45 JP1.6
RX_BT
  Bottom 1.016: PCB1.17 28.6,59.77 JP3.4
RX_LEDBAR
  Bottom 1.016: PCB1.19 23.52,59.77 JP3.6
SCL_(RTC+4D)
  Bottom 1.016: PCB1.21 18.44,59.77 JP3.8
SDA_(RTC+4D)
  Bottom 1.016: PCB1.20 20.98,59.77 JP3.7
TX_BT
  Bottom 1.016: PCB1.16 31.14,59.77 JP3.3
TX_LEDBAR
  Bottom 1.016: PCB1.18 26.06,59.77 JP3.5